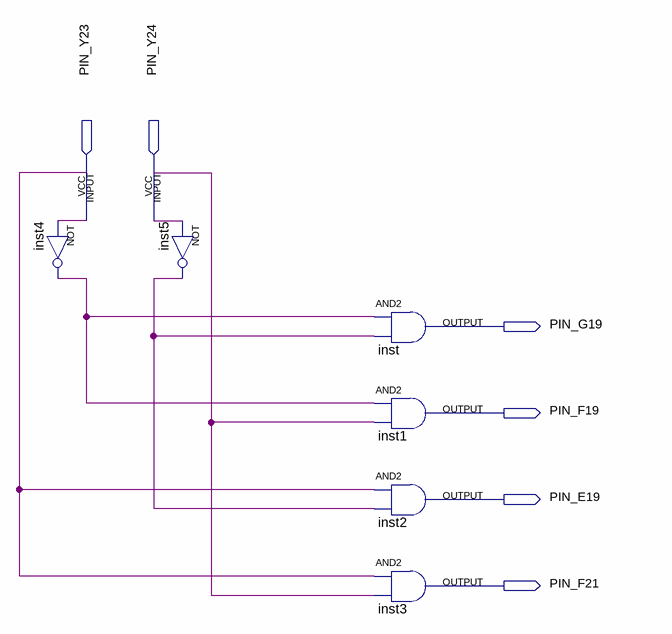
[diagram p0: schematic sheet]
// Quartus schematic Decodificador.bdf as structural Verilog: 6 symbols, 6 pins
module Decodificador (
  input  PIN_Y23,
  input  PIN_Y24,
  output PIN_G19,
  output PIN_F19,
  output PIN_E19,
  output PIN_F21
);

  wire inst4_out, inst5_out, undriven, undriven_2;

  not inst4 (inst4_out, PIN_Y23);
  not inst5 (inst5_out, PIN_Y24);
  // AND2 inst has open pins: IN1=inst4_out, IN2=inst5_out, OUT=open
  // AND2 inst1 has open pins: IN1=inst4_out, IN2=undriven_2, OUT=open
  // AND2 inst2 has open pins: IN1=undriven, IN2=inst5_out, OUT=open
  // AND2 inst3 has open pins: IN1=undriven, IN2=undriven_2, OUT=open
endmodule
